# EAGLE design HSKLtag (EAGLE 5.11)
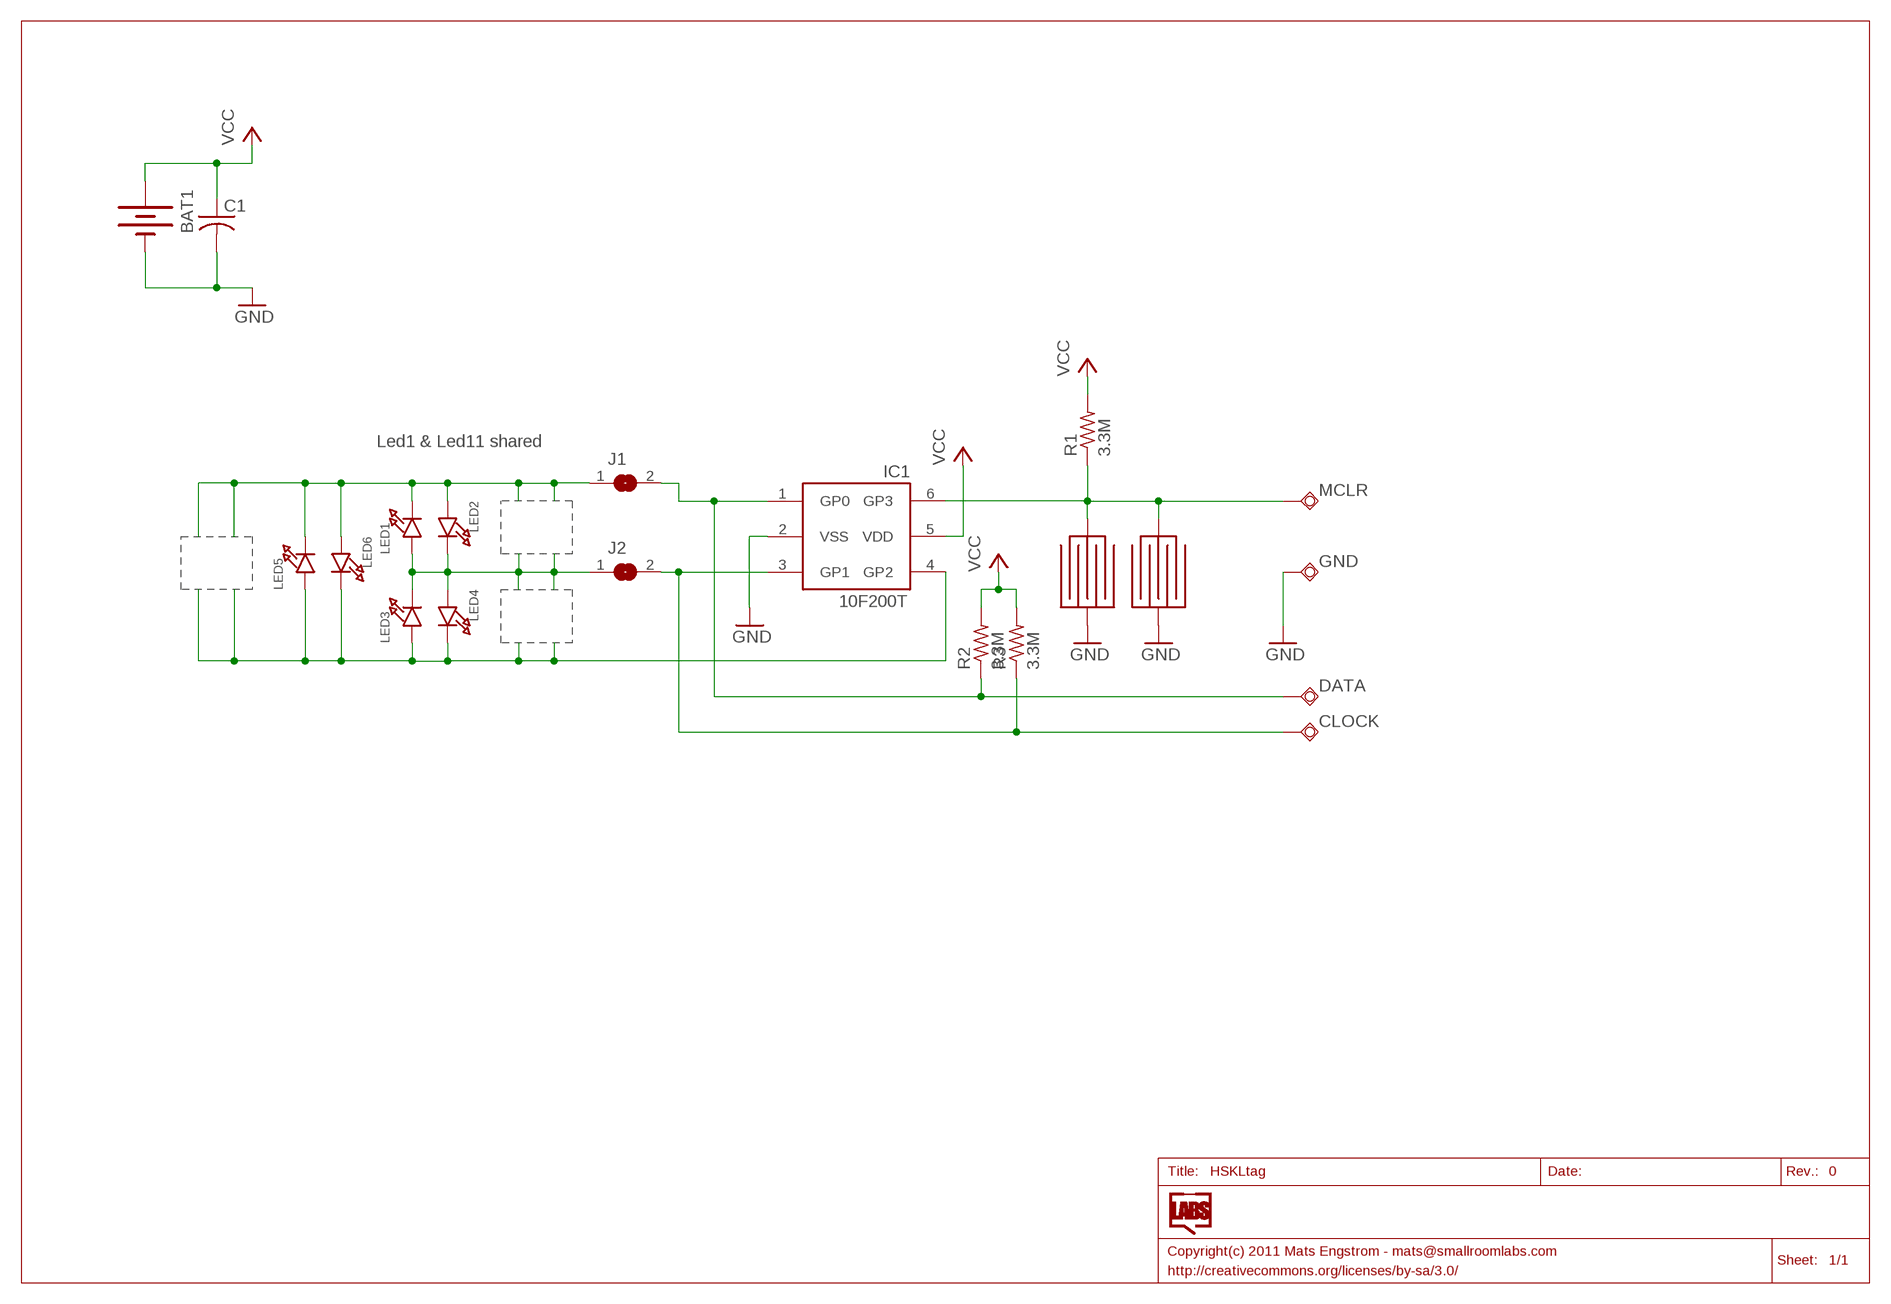
[diagram p0: schematic, sheet 1]

## Parts
BAT1  BATTERY20SMD  [BATTCON_20MM]
C1  C-USC1206  [C1206]
CLOCK  TPSQTP20SQ  [TP20SQ]
DATA  TPSQTP20SQ  [TP20SQ]
GND  TPSQTP20SQ  [TP20SQ]
IC1  10F200T  [SOT23-6]
J1  SJ  [SJ]
J2  SJ  [SJ]
LED1  LEDSMD0805  [CHIPLED_0805]
LED2  LEDSMD0805  [CHIPLED_0805]
LED3  LEDSMD0805  [CHIPLED_0805]
LED4  LEDSMD0805  [CHIPLED_0805]
LED5  LEDSMD0805  [CHIPLED_0805]
LED6  LEDSMD0805  [CHIPLED_0805]
MCLR  TPSQTP20SQ  [TP20SQ]
R1  3.3M  R-US_R0805  [R0805]
R2  3.3M  R-US_R0805  [R0805]
R3  3.3M  R-US_R0805  [R0805]
U$2  TOUCH6X6  [TOUCH6]
U$3  TOUCH6X6  [TOUCH6]

## Nets
GND: BAT1.2(-) C1.2 GND.TP IC1.2(VSS) U$2.P$1 U$3.P$1
GP0: DATA.TP IC1.1(GP0) J1.2 R2.1
GP1: CLOCK.TP IC1.3(GP1) J2.2 R3.1
GP2: IC1.4(GP2) LED3.A LED4.C LED5.A LED6.C
MCLR: IC1.6(GP3) MCLR.TP R1.1 U$2.P$2 U$3.P$2
N$1: J1.1 LED1.C LED2.A LED5.C LED6.A
N$2: J2.1 LED1.A LED2.C LED3.C LED4.A
VCC: BAT1.1(+) C1.1 IC1.5(VDD) R1.2 R2.2 R3.2

## Notes on the sheet
- Led1 & Led11 shared

## Library data of the parts
BAT1 = SparkFun:BATTERY: Battery Holders Various common sizes : AA, AAA, 20mm coin cell and 12mm coin cell.
C1 = adafruit:C-US: CAPACITOR, American symbol
CLOCK DATA GND MCLR = testpad:TPSQ: Test pad
IC1 = adafruit:10F200T: PIC10F200/202/204/206 Ultra-small 8-bit PIC micros in SOT-23-6 and SOIC
J1 J2 = jumper:SJ: SMD solder JUMPER
LED1-LED6 = SmallRoomLabs:LED
R1-R3 = adafruit:R-US_: RESISTOR, American symbol
U$2 U$3 = SmallRoomLabs:TOUCH

## Net classes
0 default: width 0.305 mm, clearance 0.305 mm

## Board
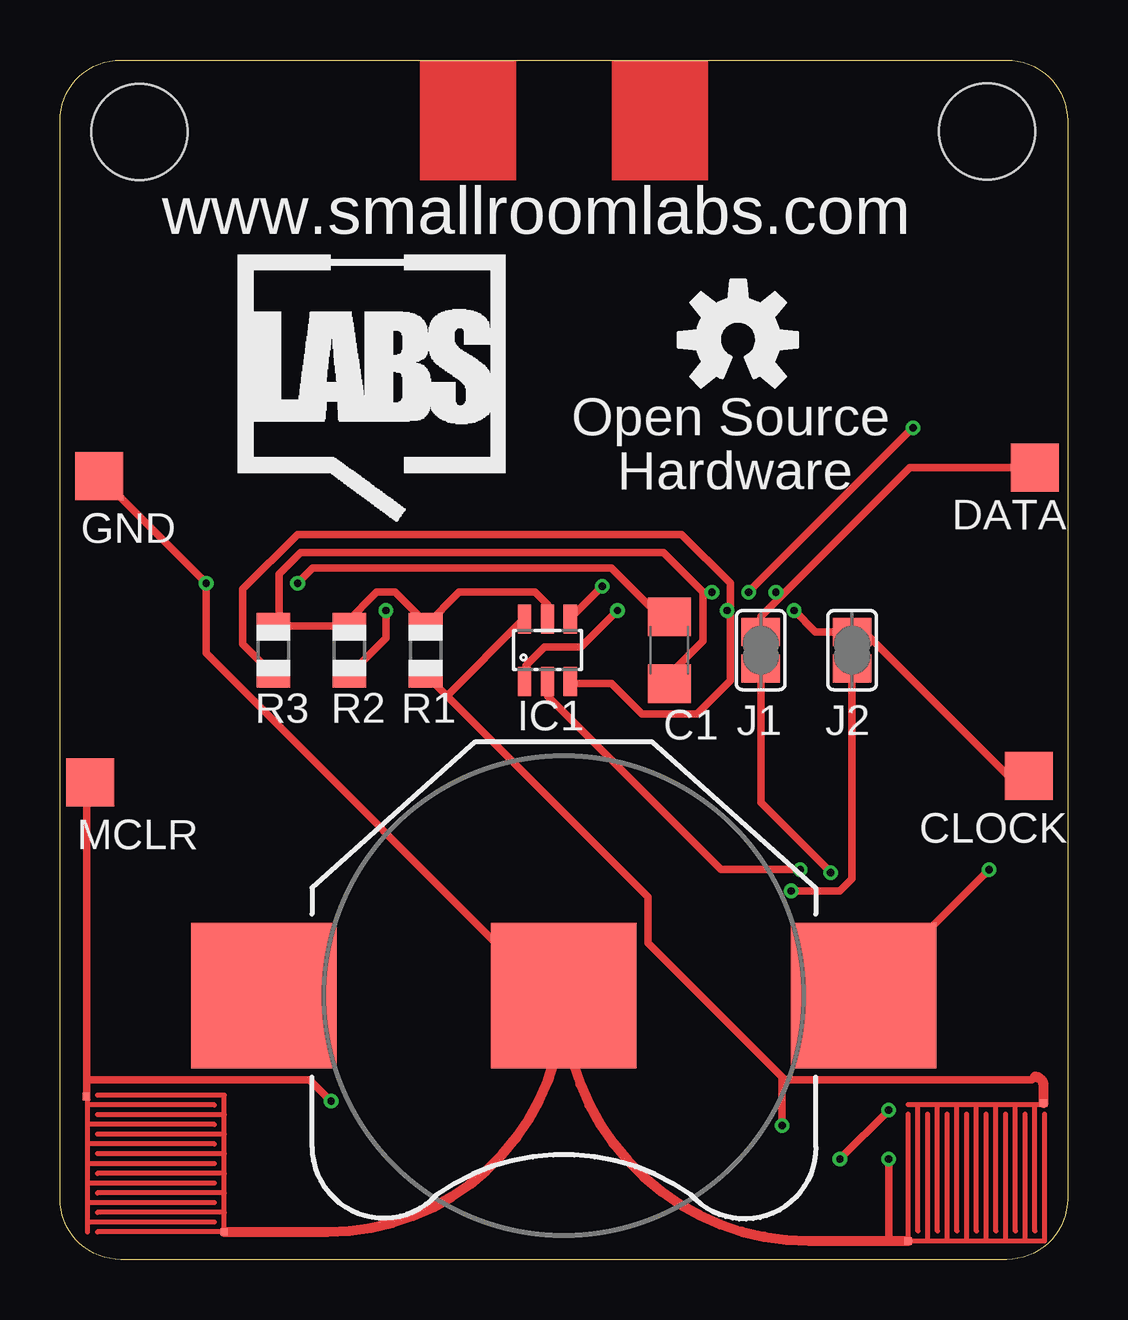
[diagram p1: board, top side]
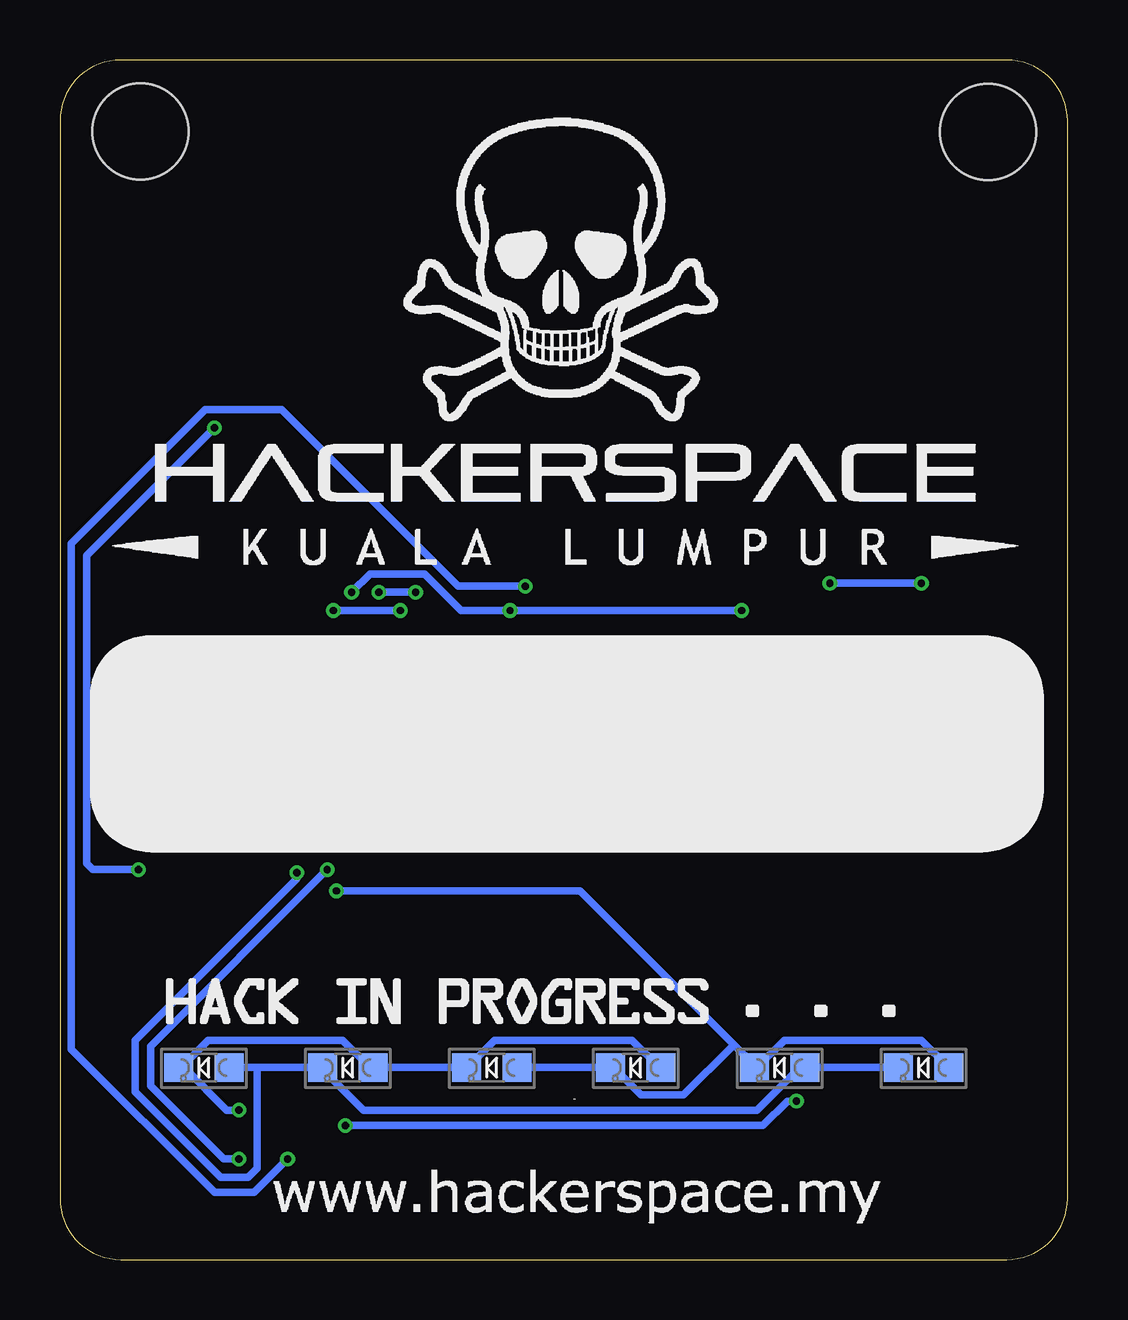
[diagram p2: board, bottom side, seen from below]

Size 42 x 50 mm. Coordinates in mm from the lower left corner, seen from the top.
Outline: 0,23 0,47.46 arc-90 2.54,50 22,50 39.46,50 arc-90 42,47.46 42,21 42,2.54 arc-90 39.46,0 20,0 2.54,0 arc-90 0,2.54 0,23
Copper layers (1*16): Top 0.035mm / dielectric 1.5mm / Bottom 0.035mm
Design rules "Fusion_eagle_rule_v1.1": minimum track width 6mil, minimum drill 12mil, track to track 6mil, track to pad 6mil, pad to pad 6mil, via to via 6mil, smd to smd 0mil, copper to edge 10mil, drill to drill 10mil, minimum pad ring 10mil, minimum via ring 6mil, stop-mask expansion 2mil, vias tented up to drill 100mil, thermal gap 10mil
Holes 4 mm at 3.32,47 38.65,47.02
bKeepout: area 0.7,16.6 to 40.7,26.6
bRestrict: area 0.7,16.6 to 40.7,26.6
vRestrict: area 0,16.6 to 43.2,26.6; area 4.4,11.4 to 36.2,14.6; area 1.9,28.6 to 40,31.1; area 3.2,31.1 to 38.7,34.3; area 8.3,1.3 to 34.9,3.8; area 10.8,0.6 to 31.1,21

### Footprints (pad centres in the part's own frame; a part is rotated, then mirrored left to right if it is on the bottom)
BATTCON_20MM = smd 6.07 x 6.07: 1 -12.5,0; 2 0,0; 3 12.5,0
C1206 = smd 1.6 x 1.8: 1 -1.4,0; 2 1.4,0
TP20SQ = smd 2 x 2: TP 0,0
SOT23-6 = smd 0.55 x 1.2: 1 -0.95,-1.3; 2 0,-1.3; 3 0.95,-1.3; 4 0.95,1.3; 5 0,1.3; 6 -0.95,1.3
SJ = smd 1.168 x 1.6: 1 -0.762,0; 2 0.762,0
CHIPLED_0805 = smd 1.2 x 1.2: A 0,-1.05; C 0,1.05
R0805 = smd 1.1 x 1.4: 1 -1,0; 2 1,0
TOUCH6 = smd 0.305 x 0.305: P$1 -2.845,2.845; P$2 2.896,-2.794

### Placement (x,y rotation side)
BAT1  21,11 180 top
C1  25.4,25.4 90 top
CLOCK  40.39,20.15 180 top
DATA  40.64,33.02 0 top
GND  1.63,32.65 180 top
IC1  20.32,25.4 0 top
J1  29.21,25.4 90 top
J2  33.02,25.4 90 top
LED1  6,8 90 bottom
LED2  12,8 90 bottom
LED3  18,8 90 bottom
LED4  24,8 90 bottom
LED5  30,8 90 bottom
LED6  36,8 90 bottom
MCLR  1.27,19.88 0 top
R1  15.24,25.4 90 top
R2  12.06,25.4 90 top
R3  8.89,25.4 90 top
U$2  38.2,3.62 90 top
U$3  4,4 180 top
U$4  [SRL-LOGO-SILK-10MM]  7.42,30.75 0 top
U$5  [OSHW-LOGO-M]  28.27,38.34 0 top

### Tracks (layer width: path | path; a pad name or v marks a point on that pad's centre or on a via)
GND  (via drill 0.3)
  Top 0.305: v9.91,28.19 10.54,28.83 22.99,28.83 24.89,26.92 25.4,26.92 C1.2 | GND.TP 1.65,32.64 v6.1,28.19 6.1,28.07 6.1,25.27 20.83,10.54 BAT1.2 | v30.86,16.26 27.56,16.26 20.32,23.5 20.32,24 IC1.2 | v34.54,4.19 34.54,0.89 34.54,0.78
  Top 0.406: U$3.P$1 11.15,1.16 arc90 BAT1.2 arc90 31.23,0.78 34.54,0.78 U$2.P$1
  Bottom 0.305: v6.1,28.19 v9.91,28.19 | v30.86,16.26 38.23,8.89 38.23,7.24 35.18,4.19 v34.54,4.19
GP0  (via drill 0.3)
  Top 0.305: v23.24,27.05 21.72,25.53 20.19,25.53 19.43,24.77 19.43,24.13 IC1.1 | v13.59,27.05 13.59,25.91 12.06,24.38 R2.1 | J1.2 29.21,26.8 30.04,27.62 | 30.04,27.62 35.43,33.02 DATA.TP | v29.84,27.81 29.97,27.69 30.04,27.62
  Bottom 0.305: v13.59,27.05 v23.24,27.05 23.37,27.05 25.27,27.05 26.8,28.57 29.08,28.57 v29.84,27.81
GP1  (via drill 0.3)
  Top 0.305: 27.94,27.05 27.94,28.19 25.91,30.23 9.91,30.23 7.62,27.94 7.62,25.65 8.89,24.38 R3.1 | 27.94,27.05 27.94,24.13 26.54,22.73 24.26,22.73 22.99,24 21.34,24 IC1.3 | v30.61,27.05 31.5,26.16 32.89,26.16 J2.2 33.15,26.16 33.53,26.16 39.5,20.19 40.39,20.19 CLOCK.TP | 27.94,27.05 v27.81,27.05
  Bottom 0.305: v27.81,27.05 v30.61,27.05
GP2  (via drill 0.3)
  Top 0.305: v22.61,28.07 21.34,26.8 IC1.4 | v34.54,6.22 v32.51,4.19
  Bottom 0.305: LED3.A 17.02,8 18.16,9.14 23.88,9.14 25.02,8 LED4.C 25.15,8 28.83,8 LED5.A 29.08,8 30.23,9.14 35.81,9.14 36.96,8 LED6.C 36.83,8 35.05,6.22 v34.54,6.22 | v22.61,28.07 25.4,28.07 32.77,35.43 35.94,35.43 41.53,29.84 41.53,8.76 35.56,2.79 33.91,2.79 v32.51,4.19
MCLR  (via drill 0.3)
  Top 0.305: 30.23,7.49 40.51,7.49 40.64,7.62 | 30.23,7.49 24.51,13.21 24.51,15.11 16.13,23.5 | 16.13,23.5 15.24,24.38 R1.1 | 16.13,23.5 19.3,26.67 IC1.6 | v11.3,6.6 10.41,7.49 10.29,7.49 1.14,7.49 1.1,7.49 | v30.1,5.59 30.1,7.49 30.23,7.49 | 1.1,19.94 1.27,19.94 MCLR.TP arc90 1.1,19.71 1.1,7.49 | U$3.P$2 1.1,7.49
  Top 0.406: U$2.P$2 40.99,7.27 arc90 40.64,7.62
  Bottom 0.305: v11.3,6.6 11.68,6.6 12.7,5.59 v30.1,5.59
N$1  (via drill 0.3)
  Top 0.305: J1.1 29.21,19.05 v32.13,16.13
  Bottom 0.305: LED1.C 7.11,8 10.92,8 LED2.A 11.05,7.87 11.3,7.87 12.95,6.22 29.34,6.22 30.99,7.87 LED5.C 31.11,8 33.78,8 | 33.78,8 34.92,8 LED6.A | v32.13,16.13 32.13,15.88 38.86,9.14 38.86,6.99 35.31,3.43 34.16,3.43 33.78,3.81 33.78,7.87 33.78,8
N$2  (via drill 0.3)
  Top 0.305: J2.1 33.02,15.88 32.51,15.37 v30.48,15.37
  Bottom 0.305: LED4.A 22.86,8 LED3.C 18.92,8 17.78,6.86 16,6.86 13.97,8.89 13.91,8.95 | LED1.A 6.1,9.14 11.81,9.14 12.95,8 LED2.C 13.08,8.13 13.91,8.95 | v30.48,15.37 20.32,15.37 13.91,8.95
VCC  (via drill 0.3)
  Top 0.305: IC1.5 20.32,26.8 20.32,27.3 19.81,27.81 16.64,27.81 15.24,26.42 R1.2 15.24,26.54 13.97,27.81 13.21,27.81 11.94,26.54 R2.2 12.06,26.42 8.89,26.42 R3.2 9.14,26.54 9.14,28.57 10.03,29.46 25.15,29.46 26.8,27.81 | 26.8,27.81 26.8,25.78 25.4,24.38 C1.1 | v38.73,16.26 33.53,11.05 BAT1.1 | v28.7,27.81 v35.56,34.67 | v27.18,27.81 26.92,27.81 26.8,27.81
  Bottom 0.305: v38.73,16.26 40.64,16.26 40.89,16.51 40.89,29.34 v35.56,34.67 | v27.18,27.81 v28.7,27.81
(copper drawn outside any net)
  shapes: Top area x2

### Text on the board
tPlace: www.smallroomlabs.com | Open Source | Hardware